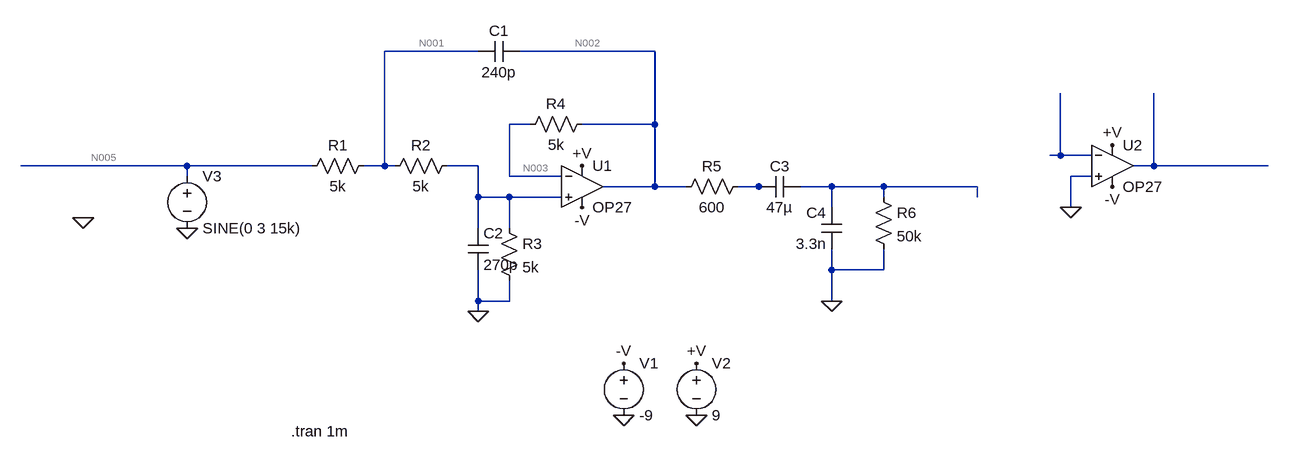
[diagram p0: schematic AD1934_output_stage_sim.asc]
AD1934_output_stage_sim.asc, the LTspice schematic file:
Version 4
SHEET 1 1688 680
WIRE -64 -16 -208 -16
WIRE 208 -16 0 -16
WIRE 16 96 -16 96
WIRE 208 96 208 -16
WIRE 208 96 96 96
WIRE 832 144 832 48
WIRE 832 144 816 144
WIRE 880 144 832 144
WIRE -512 160 -768 160
WIRE -320 160 -512 160
WIRE -208 160 -208 -16
WIRE -208 160 -240 160
WIRE -192 160 -208 160
WIRE -64 160 -112 160
WIRE 976 160 976 48
WIRE 976 160 944 160
WIRE 1152 160 976 160
WIRE -512 176 -512 160
WIRE -16 176 -16 96
WIRE 64 176 -16 176
WIRE 880 176 848 176
WIRE 208 192 208 96
WIRE 208 192 128 192
WIRE 256 192 208 192
WIRE 368 192 336 192
WIRE 384 192 368 192
WIRE 480 192 432 192
WIRE 560 192 480 192
WIRE 704 192 560 192
WIRE -64 208 -64 160
WIRE -16 208 -64 208
WIRE 64 208 -16 208
WIRE 560 208 560 192
WIRE 704 208 704 192
WIRE 480 224 480 192
WIRE 848 224 848 176
WIRE -64 256 -64 208
WIRE -16 256 -16 208
WIRE 480 320 480 288
WIRE 560 320 560 288
WIRE 560 320 480 320
WIRE -64 368 -64 320
WIRE -16 368 -16 336
WIRE -16 368 -64 368
WIRE 480 368 480 320
WIRE -64 384 -64 368
FLAG 160 544 0
FLAG 272 544 0
FLAG 160 464 -V
FLAG 272 464 +V
FLAG 96 224 -V
FLAG 96 160 +V
FLAG 912 128 +V
FLAG 912 192 -V
FLAG 848 224 0
FLAG -64 384 0
FLAG 480 368 0
FLAG -672 240 0
FLAG -512 256 0
SYMBOL voltage 160 448 R0
WINDOW 123 0 0 Left 0
WINDOW 39 0 0 Left 0
SYMATTR InstName V1
SYMATTR Value -9
SYMBOL voltage 272 448 R0
WINDOW 123 0 0 Left 0
WINDOW 39 0 0 Left 0
SYMATTR InstName V2
SYMATTR Value 9
SYMBOL OpAmps\\OP27 96 128 R0
SYMATTR InstName U1
SYMBOL OpAmps\\OP27 912 96 R0
SYMATTR InstName U2
SYMBOL res -224 144 R90
WINDOW 0 0 56 VBottom 2
WINDOW 3 32 56 VTop 2
SYMATTR InstName R1
SYMATTR Value 5k
SYMBOL res -208 176 R270
WINDOW 0 32 56 VTop 2
WINDOW 3 0 56 VBottom 2
SYMATTR InstName R2
SYMATTR Value 5k
SYMBOL cap 0 -32 R90
WINDOW 0 0 32 VBottom 2
WINDOW 3 32 32 VTop 2
SYMATTR InstName C1
SYMATTR Value 240p
SYMBOL res -32 240 R0
SYMATTR InstName R3
SYMATTR Value 5k
SYMBOL cap -80 256 R0
SYMATTR InstName C2
SYMATTR Value 270p
SYMBOL res 112 80 R90
WINDOW 0 0 56 VBottom 2
WINDOW 3 32 56 VTop 2
SYMATTR InstName R4
SYMATTR Value 5k
SYMBOL res 352 176 R90
WINDOW 0 0 56 VBottom 2
WINDOW 3 32 56 VTop 2
SYMATTR InstName R5
SYMATTR Value 600
SYMBOL cap 432 176 R90
WINDOW 0 0 32 VBottom 2
WINDOW 3 32 32 VTop 2
SYMATTR InstName C3
SYMATTR Value 47µ
SYMBOL cap 496 288 R180
WINDOW 0 24 56 Left 2
WINDOW 3 24 8 Left 2
SYMATTR InstName C4
SYMATTR Value 3.3n
SYMBOL res 544 192 R0
SYMATTR InstName R6
SYMATTR Value 50k
SYMBOL voltage -512 160 R0
WINDOW 123 0 0 Left 0
WINDOW 39 0 0 Left 0
SYMATTR InstName V3
SYMATTR Value SINE(0 3 15k)
TEXT -352 568 Left 2 !.tran 1m

The netlist it stands for:
* AD1934_output_stage_sim.asc
V1 -V 0 -9
V2 +V 0 9
XU1 N006 N003 +V -V N002 OP27  ; pins In+ In- V+ V- OUT
XU2 0 N004 +V -V N007 OP27  ; pins In+ In- V+ V- OUT
R1 N001 N005 5k
R2 N001 N006 5k
C1 N002 N001 240p
R3 N006 0 5k
C2 N006 0 270p
R4 N002 N003 5k
R5 N008 N002 600
C3 N009 N008 47µ
C4 0 N009 3.3n
R6 N009 0 50k
V3 N005 0 SINE(0 3 15k)
.tran 1m
.lib ADI.lib
.backanno
.end

* Results of the author's LTspice run, read from the files saved beside the schematic
* Operating Point, zero values left out:
*   V(-v) = -9 V
*   V(+v) = 9 V
*   I(V1) = 5.335 mA
*   I(V2) = -5.335 mA
*   Ix(u1:3) = 2.668 mA
*   Ix(u1:4) = -2.668 mA
*   Ix(u2:3) = 2.668 mA
*   Ix(u2:4) = -2.668 mA
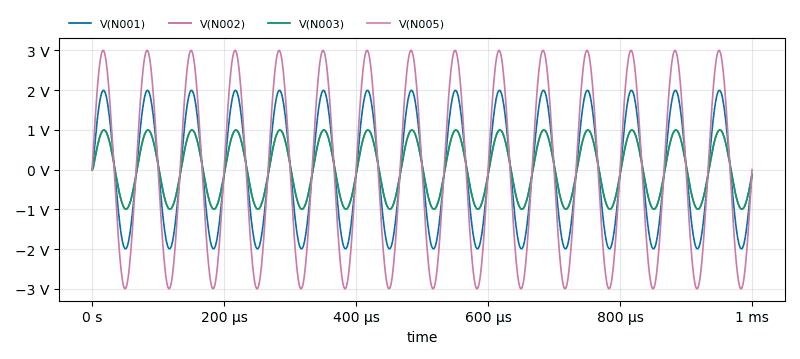
[diagram p1: Transient Analysis of AD1934_output_stage_sim.asc, plotted from the saved traces]
* Transient Analysis, 1 run:
*   V(N001): min -1.994 V, max 1.994 V, average 55.02 µV, rms 1.41 V, last -118.3 mV
*   V(N002): min -995.2 mV, max 995.2 mV, average 113.6 µV, rms 703.7 mV, last -123.3 mV
*   V(N003): min -995.2 mV, max 995.2 mV, average 115.4 µV, rms 703.7 mV, last -124.6 mV
*   V(N005): min -3 V, max 3 V, average 1.009 µV, rms 2.121 V, last 0 V